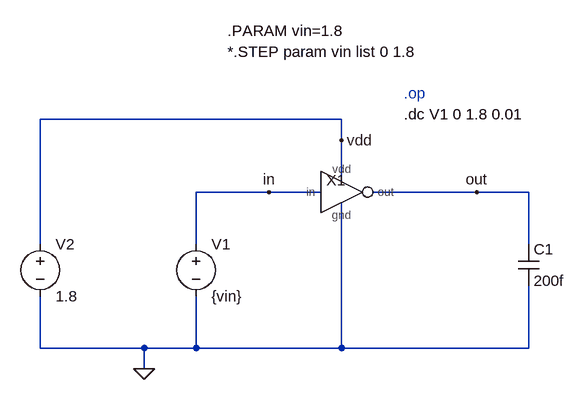
[diagram p0: schematic inv1x_tb_dctransfer.asc]
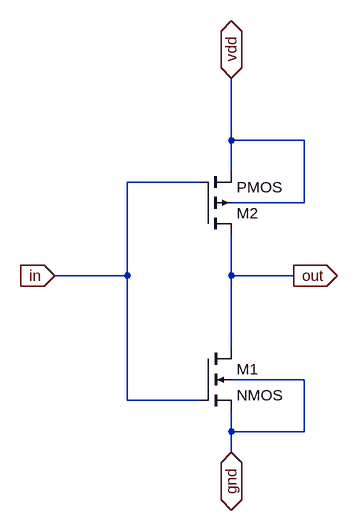
[diagram p1: sub-circuit inv1x.asc]
inv1x_tb_dctransfer.asc, the LTspice schematic file:
Version 4
SHEET 1 880 680
WIRE 192 32 -272 32
WIRE 192 64 192 32
WIRE 192 128 192 64
WIRE 80 144 -32 144
WIRE 160 144 80 144
WIRE 400 144 240 144
WIRE 480 144 400 144
WIRE -272 224 -272 32
WIRE -32 224 -32 144
WIRE 480 224 480 144
WIRE -272 384 -272 304
WIRE -112 384 -272 384
WIRE -32 384 -32 304
WIRE -32 384 -112 384
WIRE 192 384 192 160
WIRE 192 384 -32 384
WIRE 480 384 480 288
WIRE 480 384 192 384
WIRE -112 416 -112 384
FLAG -112 416 0
FLAG 80 144 in
FLAG 192 64 vdd
FLAG 400 144 out
SYMBOL inv1x 208 144 R0
SYMATTR InstName X1
SYMBOL voltage -32 208 R0
WINDOW 123 0 0 Left 0
WINDOW 39 0 0 Left 0
SYMATTR InstName V1
SYMATTR Value {vin}
SYMBOL voltage -272 208 R0
WINDOW 123 0 0 Left 0
WINDOW 39 0 0 Left 0
SYMATTR InstName V2
SYMATTR Value 1.8
SYMBOL cap 464 224 R0
SYMATTR InstName C1
SYMATTR Value 200f
TEXT 288 -8 Left 2 ;.op
TEXT 16 -104 Left 2 !.PARAM vin=1.8
TEXT 16 -72 Left 2 !*.STEP param vin list 0 1.8
TEXT 288 24 Left 2 !.dc V1 0 1.8 0.01

inv1x.asc, the sub-circuit schematic file:
Version 4
SHEET 1 880 680
WIRE 224 -128 224 -224
WIRE 336 -128 224 -128
WIRE 224 -80 224 -128
WIRE 176 -64 64 -64
WIRE 336 -32 336 -128
WIRE 336 -32 224 -32
WIRE 64 80 64 -64
WIRE 64 80 -48 80
WIRE 224 80 224 16
WIRE 320 80 224 80
WIRE 224 192 224 80
WIRE 336 240 224 240
WIRE 64 272 64 80
WIRE 176 272 64 272
WIRE 224 320 224 288
WIRE 336 320 336 240
WIRE 336 320 224 320
WIRE 224 352 224 320
FLAG 224 -224 vdd
IOPIN 224 -224 BiDir
FLAG 224 352 gnd
IOPIN 224 352 BiDir
FLAG 320 80 out
IOPIN 320 80 Out
FLAG -48 80 in
IOPIN -48 80 In
SYMBOL nmos4 176 192 R0
SYMATTR InstName M1
SYMATTR Value2 l=180n w=360n m=1
SYMBOL pmos4 176 16 M180
SYMATTR InstName M2
SYMATTR Value2 l=180n w=720n m=1

The netlist it stands for:
* inv1x_tb_dctransfer.asc
XX1 in 0 out vdd inv1x
V1 in 0 {vin}
V2 vdd 0 1.8
C1 out 0 200f

* block symbol definitions
.subckt inv1x in gnd out vdd
M1 out in gnd gnd NMOS l=180n w=360n m=1
M2 out in vdd vdd PMOS l=180n w=720n m=1
.ends inv1x

.model NMOS NMOS
.model PMOS PMOS
.lib standard.mos
* .op
.PARAM vin=1.8
*.STEP param vin list 0 1.8
.dc V1 0 1.8 0.01
.backanno
.end